# Altium schematic sheet StreamDeck_BLK-V0.SchDoc: Diagrama en bloques - Stream Deck
size A4; CheckedBy: Guido Glorioso; Author: Guido Glorioso; DrawnBy: Guido Glorioso; Engineer: Guido Glorioso; Revision: 0; SheetNumber: 1; SheetTotal: 5
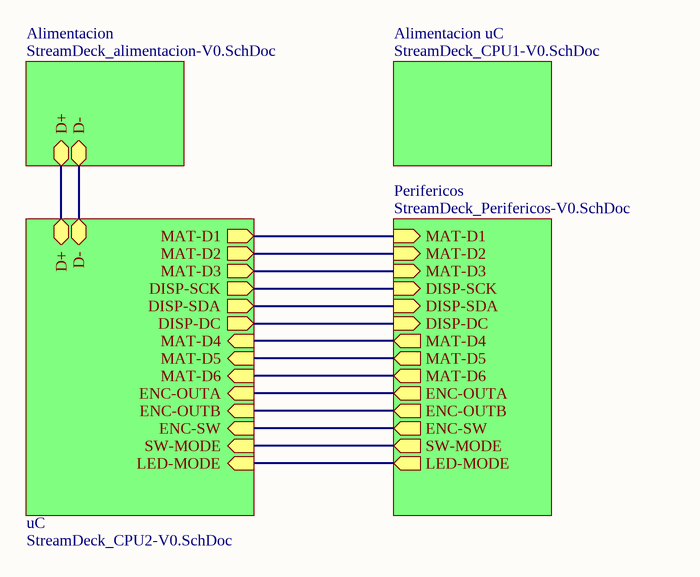
[diagram p0: StreamDeck_BLK-V0.SchDoc]

## Sub-sheets
Alimentacion = StreamDeck_alimentacion-V0.SchDoc: D+ (bidir), D- (bidir)
Alimentacion uC = StreamDeck_CPU1-V0.SchDoc: no entries
Perifericos = StreamDeck_Perifericos-V0.SchDoc: MAT-D1 (in), MAT-D2 (in), MAT-D3 (in), MAT-D4 (out), MAT-D5 (out), MAT-D6 (out), ENC-OUTA (out), ENC-OUTB (out), ENC-SW (out), SW-MODE (out), LED-MODE (out), DISP-SCK (in), DISP-SDA (in), DISP-DC (in)
uC = StreamDeck_CPU2-V0.SchDoc: MAT-D1 (out), MAT-D2 (out), MAT-D3 (out), DISP-SCK (out), DISP-SDA (out), MAT-D4 (in), MAT-D5 (in), MAT-D6 (in), ENC-OUTA (in), ENC-OUTB (in), ENC-SW (in), SW-MODE (in), LED-MODE (in), D+ (bidir), D- (bidir), DISP-DC (out)

## Nets
(unnamed): sheet Alimentacion/D+, sheet uC/D+
(unnamed): sheet Alimentacion/D-, sheet uC/D-
(unnamed): sheet uC/MAT-D1, sheet Perifericos/MAT-D1
(unnamed): sheet uC/MAT-D2, sheet Perifericos/MAT-D2
(unnamed): sheet uC/MAT-D3, sheet Perifericos/MAT-D3
(unnamed): sheet uC/DISP-SCK, sheet Perifericos/DISP-SCK
(unnamed): sheet uC/DISP-SDA, sheet Perifericos/DISP-SDA
(unnamed): sheet uC/MAT-D4, sheet Perifericos/MAT-D4
(unnamed): sheet uC/MAT-D5, sheet Perifericos/MAT-D5
(unnamed): sheet uC/MAT-D6, sheet Perifericos/MAT-D6
(unnamed): sheet uC/ENC-OUTA, sheet Perifericos/ENC-OUTA
(unnamed): sheet uC/ENC-OUTB, sheet Perifericos/ENC-OUTB
(unnamed): sheet uC/ENC-SW, sheet Perifericos/ENC-SW
(unnamed): sheet uC/SW-MODE, sheet Perifericos/SW-MODE
(unnamed): sheet uC/LED-MODE, sheet Perifericos/LED-MODE
(unnamed): sheet uC/DISP-DC, sheet Perifericos/DISP-DC

## Notes on the sheet
- Title:
- Size:
- Author:
- A4
- Sheet
- of
- Revision:
- File:
- Date: